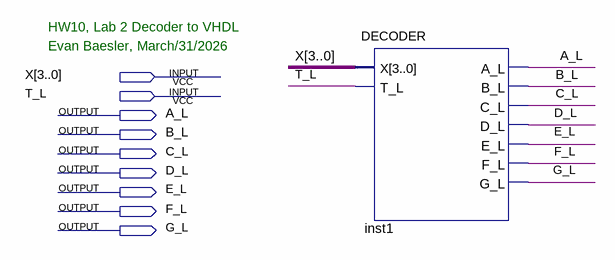
[diagram p0: schematic sheet]
// Quartus schematic Lab2ToVHDL_Decoder.bdf as structural Verilog: 1 symbols, 9 pins
module Lab2ToVHDL_Decoder (
  input  [3:0] X,
  input  T_L,
  output A_L,
  output B_L,
  output C_L,
  output D_L,
  output E_L,
  output F_L,
  output G_L
);

  DECODER inst1 (.X(X), .T_L(T_L), .A_L(A_L), .B_L(B_L), .C_L(C_L), .D_L(D_L), .E_L(E_L), .F_L(F_L), .G_L(G_L));

  // Notes on the sheet:
  //   HW10, Lab 2 Decoder to VHDL
  //   Evan Baesler, March/31/2026
endmodule
